# Altium project Mixed Signal Board Project.PrjPcb
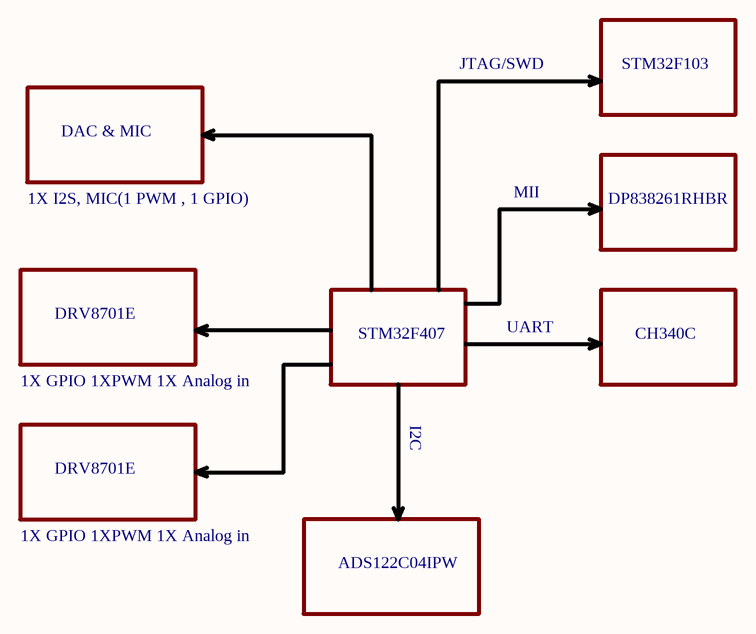
[diagram p0: [1]- Schematic Blocks.SchDoc]
9 sheets, 171 parts. Net scope: flat (ports and power ports of the same name join across sheets).
Board file: Mixed Signal Board Project.PcbDoc
Sheets:
  [1]- Schematic Blocks.SchDoc
  [3]-STM32F103 Debugger.SchDoc
  [4]- Ethernet PHY.SchDoc
  [5]-Motor Driver Schematic.SchDoc
  [6]-CH340C.SchDoc
  [8]-DAC and MIC.SchDoc
  [9]-STM32F407 Controller.SchDoc
  [10]-Motor Driver-2.SchDoc
  [11]- Power Input and Regulators.SchDoc

## Sheet [1]- Schematic Blocks.SchDoc: Sitara AM3358 Processor Board
size A4; Author: AVIRAL MISHRA; SheetNumber: 1; SheetTotal: 1; PROJECT CODE: A_V1.3

### Notes on the sheet
- JTAG/SWD
- STM32F103
- DAC & MIC
- 1X I2S, MIC(1 PWM , 1 GPIO)
- MII
- DP838261RHBR
- DRV8701E
- STM32F407
- UART
- CH340C
- 1X GPIO 1XPWM 1X Analog in
- I2C
- ADS122C04IPW
- TITLE:
- DOCUMENT NAME:
- SCALE 1:1
- This document is copyright of EsteemPCB and shall not be revealed, produced, copied, in whole or in part, nor
- PROJECT CODE:
- TEMPLATE:
- A4
- AUTHOR:
- Sheet
- of
- used for any purpose other than submitted.

## Sheet [3]-STM32F103 Debugger.SchDoc
size A4
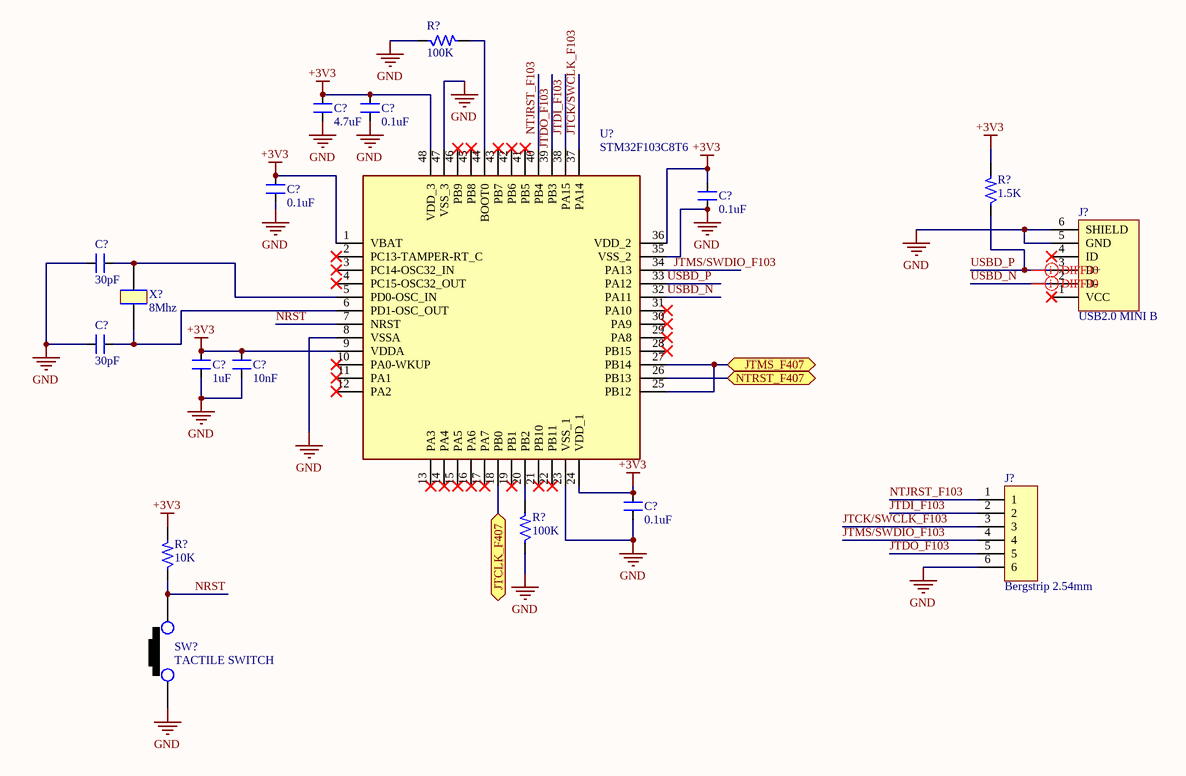
[diagram p1: [3]-STM32F103 Debugger.SchDoc]

### Parts
(Parts that share a designator on the sheet are numbered #1, #2 ... from top to bottom, then left to right.)
C?#1  4.7uF  [CAP_0805]
C?#2  0.1uF  [CAP_0805]
C?#3  0.1uF  [CAP_0805]
C?#4  0.1uF  [CAP_0805]
C?#5  30pF  [CAP_0805]
C?#6  30pF  [CAP_0805]
C?#7  1uF  [CAP_0805]
C?#8  10nF  [CAP_0805]
C?#9  0.1uF  [CAP_0805]
J?#1  USB2.0 MINI B  [CON_690-005-299-043]
J?#2  Bergstrip 2.54mm  [CON6_100_59D78_TH_ST]
R?#1  100K  [RES_0603]
R?#2  1.5K  [RES_0805]
R?#3  100K  [RES_0603]
R?#4  10K  [RES_0603]
SW?#1  TACTILE SWITCH  [SW_342_SMD]
U?#1  STM32F103C8T6  [LQFP-48_19.6_393_58X11_SMD]
X?#1  8Mhz  [XTAL_314_240X47_SMD]

### Ports
JTCLK_F407 (bidir), JTMS_F407 (bidir), NTRST_F407 (bidir)

### Nets
+3V3: C?#1.2 C?#2.2 C?#3.2 C?#4.2 C?#7.2 C?#8.2 C?#9.2 R?#2.2 R?#4.2 U?#1.1(VBAT) U?#1.9(VDDA) U?#1.24(VDD_1) U?#1.36(VDD_2) U?#1.48(VDD_3)
GND: C?#1.1 C?#2.1 C?#3.1 C?#4.1 C?#5.1 C?#6.1 C?#7.1 C?#8.1 C?#9.1 J?#1.5(GND) J?#1.6(SHIELD) J?#2.6 R?#1.1 R?#3.1 SW?#1.1 U?#1.8(VSSA) U?#1.23(VSS_1) U?#1.35(VSS_2) U?#1.47(VSS_3)  [project net SN]
JTCK/SWCLK_F103: J?#2.3 U?#1.37(PA14)
JTCLK_F407: U?#1.18(PB0) ; port JTCLK_F407
JTDI_F103: J?#2.2 U?#1.38(PA15)
JTDO_F103: J?#2.5 U?#1.39(PB3)
JTMS/SWDIO_F103: J?#2.4 U?#1.34(PA13)
JTMS_F407: U?#1.25(PB12) U?#1.27(PB14) ; port JTMS_F407
NRST: R?#4.1 SW?#1.2 U?#1.7(NRST)
NTJRST_F103: J?#2.1 U?#1.40(PB4)
NTRST_F407: U?#1.26(PB13) ; port NTRST_F407
USBD_N: J?#1.2(D-) U?#1.32(PA11)
USBD_P: J?#1.3(D+) R?#2.1 U?#1.33(PA12)
NetC?#5_2: C?#5.2 U?#1.5(PD0-OSC_IN) X?#1.2
NetC?#6_2: C?#6.2 U?#1.6(PD1-OSC_OUT) X?#1.1
NetR?#1_2: R?#1.2 U?#1.44(BOOT0)
NetR?#3_2: R?#3.2 U?#1.20(PB2)

Not connected (* = marked no-connect by the designer): J?#1 1(VCC)* 4(ID)*; U?#1 2(PC13-TAMPER-RT_C)* 3(PC14-OSC32_IN)* 4(PC15-OSC32_OUT)* 10(PA0-WKUP)* 11(PA1)* 12(PA2)* 13(PA3)* 14(PA4)* 15(PA5)* 16(PA6)* 17(PA7)* 19(PB1)* 21(PB10)* 22(PB11)* 28(PB15)* 29(PA8)* 30(PA9)* 31(PA10)* 41(PB5)* 42(PB6)* 43(PB7)* 45(PB8)* 46(PB9)*

### Layout directives
differential pair; differential pair class DIFF90: USBD_N, USBD_P

### Library data of the parts
C?#1 = CAP_4.7uF-50V-10%-0805: 4.7µF ±10% 50V Ceramic Capacitor X5R 0805 (2012 Metric) /; Manufacturer: Yageo; Manufacturer Part Number: GRM21BR61H475KE51L; Alternate Part Number-1: NA; Case/Package: 0805; Supplier-1: SIRICOM; Supplier Part Number-1: CL21A475KBQNNNE
C?#2-C?#4 C?#9 = CAP_0.1uF-50V-10%-0805: 0.1µF ±10% 50V Ceramic Capacitor X7R 0805 (2012 Metric) /; Manufacturer: Samsung; Manufacturer Part Number: CL21B104KBCNNNC; Alternate Part Number-1: NA; Case/Package: 0805; Supplier-1: SIRICOM; Supplier Part Number-1: 0805B104K500CT
C?#5 C?#6 = CAP_30pF-50V-10%-0805: ±10% 50V Ceramic Capacitor C0G, NP0 0805 (2012 Metric) /; Manufacturer Part Number: C0805C300K5GAC7800; Manufacturer: KEMET; Alternate Part Number: NA; Case/Package: 0805; Supplier-1: Digikey; Supplier Part Number-1: 399-17443-1-ND - Cut Tape (CT)
C?#7 = CAP_1uF-50V-5%-0805: 1µF ±5% 50V Ceramic Capacitor X7R 0805 (2012 Metric) /; Manufacturer: Samsung; Manufacturer Part Number: CC0805JKX7R9BB105; Alternate Part Number-1: 0805F105M500NT; Case/Package: 0805; Supplier-1: SIRICOM; Supplier Part Number-1: CL21B105KBFNNNE
C?#8 = CAP_10nF-50V-10%-0805: 10000pF ±10% 50V Ceramic Capacitor X7R 0805 (2012 Metric) /; Manufacturer: Samsung; Manufacturer Part Number: C0805C103K5RECAUTO; Alternate Part Number-1: GRM2195C1H103JA01D; Case/Package: 0805; Supplier-1: SIRICOM; Supplier Part Number-1: 0805B103K500CT
J?#1 = CON_USB2.0-MINIB-SMD: USB - mini B USB 2.0 Receptacle Connector 5 Position Surface Mount, Right Angle; Manufacturer: EDAC; Manufacturer Part Number: 690-005-299-043; Alternate Part Number-1: NA; Case/Package: USB-MINI-B; Supplier-1: LCSC; Supplier Part Number-1: C105424
J?#2 = CON-BS-SKT_6X1-100-ST-TH: 6 Pins, 1 Row 2.54mm Pitch, Straight bergstrip, Female; Manufacturer: Molex; Alternate Part Number-1: NA; Manufacturer Part Number: 22-10-2061; Case/Package: TH-CON; Supplier-1: SP ROAD; Supplier Part Number-1: NA
R?#1 R?#3 = RES_100K-0.1W-1%-0603: 100 kOhms ±1% 0.1W, 1/10W Chip Resistor 0603 (1608 Metric) Automotive AEC-Q200 Thick Film /; Manufacturer: Stackpole Electronics; Manufacturer Part Number: RMCF0603FT100K; Alternate Part Number-1: NA; Case/Package: 0603; Supplier-1: Arrow; Supplier Part Number-1: RMCF0603FT100K
R?#2 = RES_1.5K-0.125W-1%-0805: 1.5 kOhms ±1% 0.125W, 1/8W Chip Resistor 0805 (2012 Metric) Thick Film /; Manufacturer: TE Connectivity Passive Product; Manufacturer Part Number: CRG0805F1K5; Alternate Part Number-1: NA; Case/Package: 0805; Supplier-1: SIRICOM; Supplier Part Number-1: NA
R?#4 = RES_10K-0.1W-1%-0603: 10 kOhms ±1% 0.1W, 1/10W Chip Resistor 0603 (1608 Metric) Automotive AEC-Q200 Thick Film /; Manufacturer: Walsin; Manufacturer Part Number: WR06X1002FTL; Alternate Part Number-1: 0603WAJ0103T5E; Case/Package: 0603; Supplier-1: SIRICOM; Supplier Part Number-1: WR06X1002FTL
SW?#1 = SW1_RS-282G05A3-SMRT-SMD: Tactile Switch SPST-NO Top Actuated Surface Mount; Manufacturer: ITT C&K; Alternate Part Number-1: NA; Manufacturer Part Number: RS-282G05A3-SMRT; Case/Package: SMD; Supplier-1: SP ROAD; Supplier Part Number-1: RS-282G05A3-SMRT
U?#1 = IC_STM32F103C8T6: ARM® Cortex®-M3 STM32F1 Microcontroller IC 32-Bit 72MHz 64KB (64K x 8) FLASH 48-LQFP (7x7) /; Manufacturer: STMicroelectronics; Alternate Part Number-1: NA; Manufacturer Part Number: STM32F103C8T6; Case/Package: LQFP48; Supplier-1: LCSC; Supplier Part Number-1: STM32F103C8T6
X?#1 = XTAL_8MHZ-ECS-80-32-5PX-SMD: 8MHz ±30ppm Crystal 32pF 60 Ohms HC-49/US /; Manufacturer: Fox Electronics; Manufacturer Part Number: ECS-80-32-5PX-TR; Alternate Part Number-1: NA; Case/Package: SMD/SMT; Supplier-1: SP ROAD; Supplier Part Number-1: ECS-80-32-5PX-TR

## Sheet [4]- Ethernet PHY.SchDoc
size A4
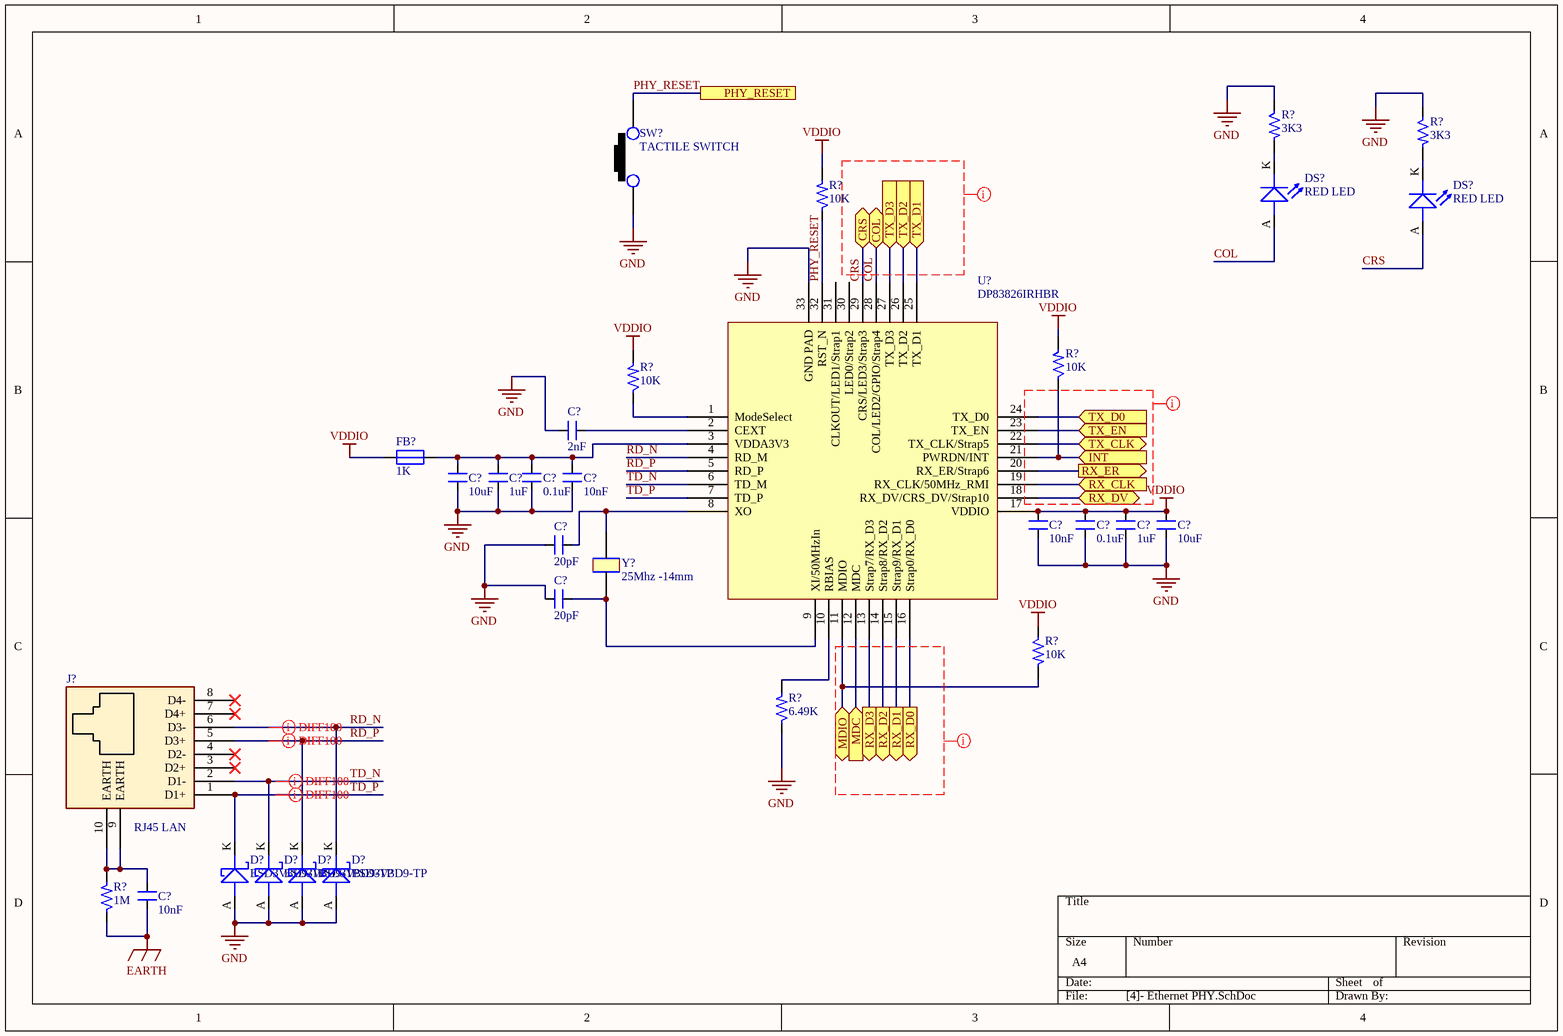
[diagram p2: [4]- Ethernet PHY.SchDoc]

### Parts
(Parts that share a designator on the sheet are numbered #1, #2 ... from top to bottom, then left to right.)
C?#10  2nF
C?#11  10uF  [CAP_1206]
C?#12  1uF  [CAP_0805]
C?#13  0.1uF  [CAP_0805]
C?#14  10nF  [CAP_0805]
C?#15  10nF  [CAP_0805]
C?#16  0.1uF  [CAP_0805]
C?#17  1uF  [CAP_0805]
C?#18  10uF  [CAP_1206]
C?#19  20pF  [CAP_0805]
C?#20  20pF  [CAP_0805]
C?#21  10nF  [CAP_P196_102X287_H332_RAD_TH]
D?#1  ESD3V3D9-TP
D?#2  ESD3V3D9-TP
D?#3  ESD3V3D9-TP
D?#4  ESD3V3D9-TP
DS?#1  RED LED  [LED_0805]
DS?#2  RED LED  [LED_0805]
FB?#1  1K  [IND_0805]
J?#3  RJ45 LAN  [CON10_P106_RJ45_TH_ST]
R?#5  3K3  [RES_0603]
R?#6  3K3  [RES_0603]
R?#7  10K  [RES_0603]
R?#8  10K  [RES_0603]
R?#9  10K  [RES_0603]
R?#10  10K  [RES_0603]
R?#11  6.49K  [RES_0805]
R?#12  1M  [RES_1206]
SW?#2  TACTILE SWITCH  [SW_342_SMD]
U?#2  DP83826IRHBR
Y?  25Mhz -14mm  [XTAL_314_240X47_SMD]

### Ports
COL (bidir), CRS (bidir), INT (in), MDC (in), MDIO (bidir), PHY_RESET, RX_CLK (in), RX_D0 (out), RX_D1 (out), RX_D2 (out), RX_D3 (out), RX_DV (bidir), RX_ER (out), TX_CLK (bidir), TX_D0 (in), TX_D1 (in), TX_D2 (in), TX_D3 (in), TX_EN (in)

### Nets
EARTH: C?#21.1 R?#12.1
GND: C?#10.1 C?#11.1 C?#12.1 C?#13.1 C?#14.1 C?#15.1 C?#16.1 C?#17.1 C?#18.1 C?#19.1 C?#20.1 D?#1.A D?#2.A D?#3.A D?#4.A R?#5.1 R?#6.1 R?#11.1 SW?#2.1 U?#2.33(GND_PAD)  [project net SN]
VDDIO: C?#15.2 C?#16.2 C?#17.2 C?#18.2 FB?#1.1 R?#7.2 R?#8.2 R?#9.2 R?#10.1 U?#2.17(VDDIO)
COL: DS?#1.A(ANODE) U?#2.28(COL/LED2/GPIO/Strap4) ; port COL
CRS: DS?#2.A(ANODE) U?#2.29(CRS/LED3/Strap3) ; port CRS
INT: R?#8.1 U?#2.21(PWRDN/INT) ; port INT
MDC: U?#2.12(MDC) ; port MDC
MDIO: R?#10.2 U?#2.11(MDIO) ; port MDIO
PHY_RESET: R?#7.1 SW?#2.2 U?#2.32(RST_N) ; port PHY_RESET
RD_N: D?#4.K J?#3.6(D3-) U?#2.4(RD_M)
RD_P: D?#3.K J?#3.5(D3+) U?#2.5(RD_P)
RX_CLK: U?#2.19(RX_CLK/50MHz_RMI) ; port RX_CLK
RX_D0: U?#2.16(Strap0/RX_D0) ; port RX_D0
RX_D1: U?#2.15(Strap9/RX_D1) ; port RX_D1
RX_D2: U?#2.14(Strap8/RX_D2) ; port RX_D2
RX_D3: U?#2.13(Strap7/RX_D3) ; port RX_D3
RX_DV: U?#2.18(RX_DV/CRS_DV/Strap10) ; port RX_DV
RX_ER: U?#2.20(RX_ER/Strap6) ; port RX_ER
TD_N: D?#2.K J?#3.2(D1-) U?#2.6(TD_M)
TD_P: D?#1.K J?#3.1(D1+) U?#2.7(TD_P)
TX_CLK: U?#2.22(TX_CLK/Strap5) ; port TX_CLK
TX_D0: U?#2.24(TX_D0) ; port TX_D0
TX_D1: U?#2.25(TX_D1) ; port TX_D1
TX_D2: U?#2.26(TX_D2) ; port TX_D2
TX_D3: U?#2.27(TX_D3) ; port TX_D3
TX_EN: U?#2.23(TX_EN) ; port TX_EN
NetC?#10_2: C?#10.2 U?#2.2(CEXT)
NetC?#11_2: C?#11.2 C?#12.2 C?#13.2 C?#14.2 FB?#1.2 U?#2.3(VDDA3V3)
NetC?#19_2: C?#19.2 U?#2.8(XO) Y?.2
NetC?#20_2: C?#20.2 U?#2.9(XI/50MHzIn) Y?.1
NetC?#21_2: C?#21.2 J?#3.9(EARTH) J?#3.10(EARTH) R?#12.2
NetDS?#1_K: DS?#1.K(CATHODE) R?#5.2
NetDS?#2_K: DS?#2.K(CATHODE) R?#6.2
NetR?#9_1: R?#9.1 U?#2.1(ModeSelect)
NetR?#11_2: R?#11.2 U?#2.10(RBIAS)

Not connected (* = marked no-connect by the designer): J?#3 3(D2+)* 4(D2-)* 7(D4+)* 8(D4-)*; U?#2 30(LED0/Strap2) 31(CLKOUT/LED1/Strap1)

### Layout directives
differential pair; differential pair class DIFF100: RD_N, RD_P, TD_N, TD_P
net class 50OHM: (no net found under the mark)

### Library data of the parts
C?#10 = CAP_2nF-50V-10%-0805: 2000pF ±10% 50V Ceramic Capacitor X7R 0805 (2012 Metric) /; Parameter 1: *
C?#11 C?#18 = CAP_10uF-50V-10%-1206: 10µF ±10% 50V Ceramic Capacitor X7R 1206 (3216 Metric) /; Manufacturer: KEMET; Manufacturer Part Number: CL31B106KBHNNNE; Alternate Part Number-1: GRT31CR61H106ME01L; Case/Package: 1206; Supplier-1: SIRICOM; Supplier Part Number-1: CC1206KKX5R9BB106
C?#12 C?#17 = CAP_1uF-50V-5%-0805: as C?#7 on sheet [3]-STM32F103 Debugger; Case/Package: 0805; Supplier-1: SIRICOM; Supplier Part Number-1: CL21B105KBFNNNE
C?#13 C?#16 = CAP_0.1uF-50V-10%-0805: as C?#2 on sheet [3]-STM32F103 Debugger; Case/Package: 0805; Supplier-1: SIRICOM; Supplier Part Number-1: 0805B104K500CT
C?#14 C?#15 = CAP_10nF-50V-10%-0805: as C?#8 on sheet [3]-STM32F103 Debugger; Case/Package: 0805; Supplier-1: SIRICOM; Supplier Part Number-1: 0805B103K500CT
C?#19 C?#20 = CAP_20pF-50V-10%-0805: ±10% 50V Ceramic Capacitor C0G, NP0 0805 (2012 Metric) /; Manufacturer: AVX Corporation; Manufacturer Part Number: 08055A200KAT2A; Alternate Part Number-1: NA; Case/Package: 0805; Supplier-1: Digikey; Supplier Part Number-1: 478-11887-1-ND - Cut Tape (CT)
C?#21 = CAP_10nF-1KV-10%-RAD-TH: 10000pF ±10% 1000V (1kV) Ceramic Capacitor X7R Radial /; Manufacturer: Yageo; Manufacturer Part Number: RDER73A103K2K1H03B; Alternate Part Number-1: NA; Case/Package: TH; Supplier-1: SP ROAD; Supplier Part Number-1: RDER73A103K2K1H03B
D?#1-D?#4 = DIO-T_3.3V-8.8V-SOD923: 8.8V Clamp 5A (8/20µs) Ipp Tvs Diode Surface Mount SOD-923 /
DS?#1 DS?#2 = LED_RED-2V-20mA-0805: Red 631nm LED Indication - Discrete 2V 0805 (2012 Metric); Manufacturer: Vishay Lite-On; Manufacturer Part Number: LTST-C171KRKT; Alternate Part Number-1: NA; Case/Package: 0805; Supplier-1: SP ROAD; Supplier Part Number-1: LTST-C171KRKT
FB?#1 = FB_1K-100MHZ-1.6A-0805: 1 kOhms @ 100MHz 1 Power Line Ferrite Bead 0805 (2012 Metric) 1.6A; Manufacturer: Laird; Manufacturer Part Number: BLM21SP102SH1D; Alternate Part Number-1: NA; Case/Package: 0805; Supplier-1: SIRICOM; Supplier Part Number-1: ACMS201209A102
J?#3 = CON-SKT-RJ_8C8P-RA-TH: 8 Pins, 2 Row 2.54mm Pitch, right angle Connector, male; Manufacturer: Assmann; Manufacturer Part Number: A-2004-2-4-LPS-N-R; Alternate Part Number-1: NA; Case/Package: TH-CON; Supplier-1: SP ROAD; Supplier Part Number-1: A-2004-2-4-LPS-N-R
R?#5 R?#6 = RES_3.3K-0.1W-1%-0603: 3.3 kOhms ±1% 0.1W, 1/10W Chip Resistor 0603 (1608 Metric) Automotive AEC-Q200 Thick Film /; Manufacturer: Wilson; Manufacturer Part Number: WR06X3301FTL; Alternate Part Number-1: 0603WAF3301T5E; Case/Package: 0603; Supplier-1: SIRICOM; Supplier Part Number-1: WR06X3301FTL
R?#7-R?#10 = RES_10K-0.1W-1%-0603: as R?#4 on sheet [3]-STM32F103 Debugger; Case/Package: 0603; Supplier-1: SIRICOM; Supplier Part Number-1: WR06X1002FTL
R?#11 = RES_6.49K-0.125W-1%-0805: 6.49 kOhms ±1% 0.125W, 1/8W Chip Resistor 0805 (2012 Metric) Moisture Resistant Thick Film /; Manufacturer: Stackpole Electronics; Manufacturer Part Number: RC0805FR-076K49L; Alternate Part Number-1: NA; Case/Package: 0805; Supplier-1: SIRICOM; Supplier Part Number-1: WRO8X6491FTL
R?#12 = RES_1M-0.25W-1%-1206: 1 MOhms ±1% 0.25W, 1/4W Chip Resistor 1206 (3216 Metric) Automotive AEC-Q200, High Voltage Thick Film /; Manufacturer: Walsin; Manufacturer Part Number: WR12X1004FTL; Alternate Part Number-1: NA; Case/Package: 1206; Supplier-1: SIRICOM; Supplier Part Number-1: WR12X1004FTL
SW?#2 = SW1_RS-282G05A3-SMRT-SMD: as SW?#1 on sheet [3]-STM32F103 Debugger; Manufacturer Part Number: RS-282G05A3-SMRT; Case/Package: SMD; Supplier-1: SP ROAD; Supplier Part Number-1: RS-282G05A3-SMRT
U?#2 = IC_DP83826IRHBR
Y? = XTAL_25Mhz-FOXSDLF/250F-20: 25MHz ±30ppm Crystal 20pF 30 Ohms HC-49/US /; Manufacturer: Abracon; Alternate Part Number-1: NA; Manufacturer Part Number: FOXSDLF/250F-20; Case/Package: SMD; Supplier-1: MOUSER; Supplier Part Number-1: FOXSDLF/250F-20

## Sheet [5]-Motor Driver Schematic.SchDoc
size A4
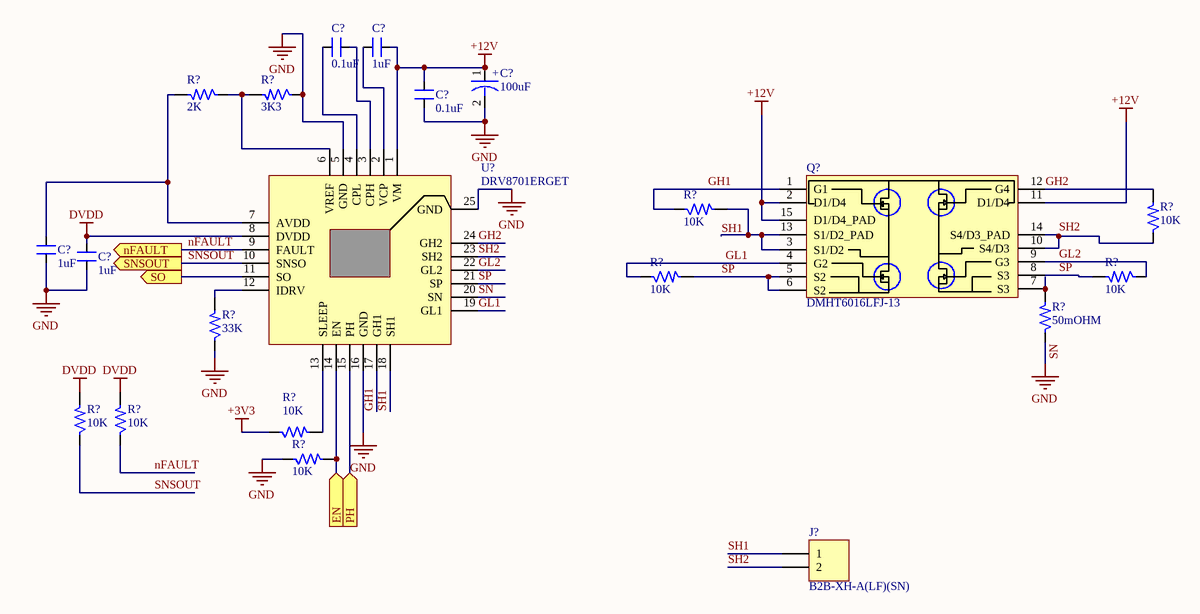
[diagram p3: [5]-Motor Driver Schematic.SchDoc]

### Parts
(Parts that share a designator on the sheet are numbered #1, #2 ... from top to bottom, then left to right.)
C?#22  0.1uF  [CAP_0805]
C?#23  1uF  [CAP_0805]
C?#24  100uF  [ACAP_P236_D305_H303_RAD]
C?#25  0.1uF  [CAP_0805]
C?#26  1uF  [CAP_0805]
C?#27  1uF  [CAP_0805]
J?#4  B2B-XH-A(LF)(SN)  [CON2_100_B2B-XH-A_TH_ST]
Q?#1  DMHT6016LFJ-13  [DFN5045-12_33_212_27X15_SMD_1]
R?#13  2K  [RES_0603]
R?#14  3K3  [RES_0603]
R?#15  10K  [RES_0603]
R?#16  10K  [RES_0603]
R?#17  10K  [RES_0603]
R?#18  10K  [RES_0603]
R?#19  50mOHM  [RES_2512]
R?#20  33K  [RES_0805]
R?#21  10K  [RES_0603]
R?#22  10K  [RES_0603]
R?#23  10K  [RES_0603]
R?#24  10K  [RES_0603]
U?#3  DRV8701ERGET  [VFQFN24_19.6_196_12X32_SMD_1]

### Ports
EN (in), nFAULT (out), PH (in), SNSOUT (out), SO (out)

### Nets
+3V3: R?#21.1
+12V: C?#23.2 C?#24.1 C?#25.2 Q?#1.2(D1/D4) Q?#1.11(D1/D4) Q?#1.15(D1/D4_PAD) U?#3.1(VM)
DVDD: C?#27.2 R?#22.2 R?#23.2 U?#3.8(DVDD)
SN: C?#24.2 C?#25.1 C?#26.1 C?#27.1 R?#14.1 R?#19.1 R?#20.1 R?#24.1 U?#3.5(GND) U?#3.16(GND) U?#3.20(SN) U?#3.25(GND)  [also labelled GND]
EN: R?#24.2 U?#3.14(EN) ; port EN
GH1: Q?#1.1(G1) R?#15.1 U?#3.17(GH1)
GH2: Q?#1.12(G4) R?#16.2 U?#3.24(GH2)
GL1: Q?#1.4(G2) R?#17.1 U?#3.19(GL1)
GL2: Q?#1.9(G3) R?#18.1 U?#3.22(GL2)
nFAULT: R?#23.1 U?#3.9(FAULT) ; port nFAULT
PH: U?#3.15(PH) ; port PH
SH1: J?#4.1 Q?#1.3(S1/D2) Q?#1.13(S1/D2_PAD) R?#15.2 U?#3.18(SH1)
SH2: J?#4.2 Q?#1.10(S4/D3) Q?#1.14(S4/D3_PAD) R?#16.1 U?#3.23(SH2)
SNSOUT: R?#22.1 U?#3.10(SNSO) ; port SNSOUT
SO: U?#3.11(SO) ; port SO
SP: Q?#1.5(S2) Q?#1.6(S2) Q?#1.8(S3) R?#17.2 R?#18.2 U?#3.21(SP)
NetC?#22_1: C?#22.1 U?#3.3(CPH)
NetC?#22_2: C?#22.2 U?#3.4(CPL)
NetC?#23_1: C?#23.1 U?#3.2(VCP)
NetC?#26_2: C?#26.2 R?#13.2 U?#3.7(AVDD)
NetQ?#1_7: Q?#1.7(S3) R?#19.2
NetR?#13_1: R?#13.1 R?#14.2 U?#3.6(VREF)
NetR?#20_2: R?#20.2 U?#3.12(IDRV)
NetR?#21_2: R?#21.2 U?#3.13(SLEEP)

### Notes on the sheet
- (in symbol CAP-P_100uF-25V-20%-RAD) +

### Library data of the parts
C?#22 C?#25 = CAP_0.1uF-50V-10%-0805: as C?#2 on sheet [3]-STM32F103 Debugger; Case/Package: 0805; Supplier-1: SIRICOM; Supplier Part Number-1: 0805B104K500CT
C?#23 C?#26 C?#27 = CAP_1uF-50V-5%-0805: as C?#7 on sheet [3]-STM32F103 Debugger; Case/Package: 0805; Supplier-1: SIRICOM; Supplier Part Number-1: CL21B105KBFNNNE
C?#24 = CAP-P_100uF-25V-20%-RAD: 100µF 25V Aluminum Electrolytic Capacitors Radial, Can - SMD 1000 Hrs @ 105°C /; Manufacturer: Nichicon; Manufacturer Part Number: UWT1E101MCL1GS; Alternate Part Number-1: NA; Case/Package: Radial-SMD; Supplier-1: SP ROAD; Supplier Part Number-1: UWT1E101MCL1GS
J?#4 = CON-PLG_2X1-100-ST-TH: 2 Pins, 1 Row 2.54mm Pitch, Straight Connector, male; Manufacturer: JST; Mating Part Number: XHP-2; Crimp Part Number: ASXHSXH22K51; Alternate Part Number-1: NA; Manufacturer Part Number: B2B-XH-A(LF)(SN); Case/Package: TH-CON; Supplier-1: SP ROAD; Supplier Part Number-1: B2B-XH-A(LF)(SN)
Q?#1 = MOSFET-N_60V-14.8A-V-DFN5045-12: Mosfet Array 4 N-Channel 14.8A (Ta) Surface Mount V-DFN5045-12; Manufacturer: ON Semiconductor; Alternate Part Number-1: DMHT3006LFJ-13; Manufacturer Part Number: DMHT6016LFJ-13; Case/Package: DFN5045-12; Supplier-1: LCSC; Supplier Part Number-1: C460986
R?#13 = RES_2K-0.125W-1%-0603: 2 kOhms ±1% 0.125W, 1/8W Chip Resistor 0603 (1608 Metric) Anti-Sulfur, Moisture Resistant Thin Film /; Manufacturer: Stackpole Electronics; Manufacturer Part Number: RNCP0603FTD2K00; Alternate Part Number-1: NA; Case/Package: 0603; Supplier-1: SIRICOM; Supplier Part Number-1: WR06X2001FTL
R?#14 = RES_3.3K-0.1W-1%-0603: as R?#5 on sheet [4]- Ethernet PHY; Case/Package: 0603; Supplier-1: SIRICOM; Supplier Part Number-1: WR06X3301FTL
R?#15-R?#18 R?#21-R?#24 = RES_10K-0.1W-1%-0603: as R?#4 on sheet [3]-STM32F103 Debugger; Case/Package: 0603; Supplier-1: SIRICOM; Supplier Part Number-1: WR06X1002FTL
R?#19 = RES_50mOhm-2W-1%-2512: 50 mOhms ±1% 2W Chip Resistor 2512 (6432 Metric) Automotive AEC-Q200, Current Sense, Moisture Resistant Metal Element /; Manufacturer: Yageo; Manufacturer Part Number: PA2512FKF7W0R05E; Alternate Part Number-1: PMR100HZPFU5L00; Case/Package: 2512; Supplier-1: SIRICOM; Supplier Part Number-1: LR2512-22R060F1
R?#20 = RES_33K-0.125W-1%-0805: Thick Film Resistors - SMD 33KOhms 1/8W 150V33 kOhms ±1% 0.125W, 1/8W Chip Resistor 0805 (2012 Metric) Thick Film /; Manufacturer: Vishay BCcomponents; Manufacturer Part Number: CRG0805F33K; Alternate Part Number-1: NA; Case/Package: 0805; Supplier-1: SIRICOM; Supplier Part Number-1: WR08X3302FTL
U?#3 = IC_DRV8701ERGET: Motor Driver Power MOSFET Parallel 24-VQFN (4x4); Manufacturer: Texas Instruments; Alternate Part Number-1: NA; Manufacturer Part Number: DRV8701ERGET; Case/Package: VFQFN24; Supplier-1: ARROW; Supplier Part Number-1: DRV8701ERGET

## Sheet [6]-CH340C.SchDoc
size A4
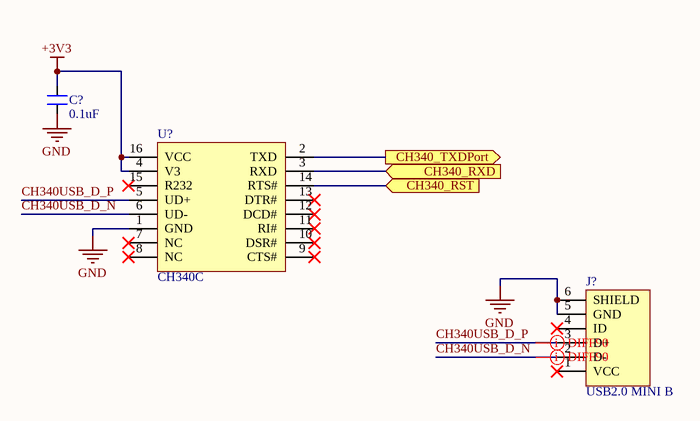
[diagram p4: [6]-CH340C.SchDoc]

### Parts
(Parts that share a designator on the sheet are numbered #1, #2 ... from top to bottom, then left to right.)
C?#28  0.1uF  [CAP_0805]
J?#5  USB2.0 MINI B  [CON_690-005-299-043]
U?#4  CH340C  [SOIC16_50_284_25X90_SMT]

### Ports
CH340_RST (in), CH340_RXD (in), CH340_TXDPort (out)

### Nets
+3V3: C?#28.2 U?#4.4(V3) U?#4.16(VCC)
GND: C?#28.1 J?#5.5(GND) J?#5.6(SHIELD) U?#4.1(GND)  [project net SN]
CH340_RST: U?#4.14(RTS#) ; port CH340_RST
CH340_RXD: U?#4.3(RXD) ; port CH340_RXD
CH340_TXDPort: U?#4.2(TXD) ; port CH340_TXDPort
CH340USB_D_N: J?#5.2(D-) U?#4.6(UD-)
CH340USB_D_P: J?#5.3(D+) U?#4.5(UD+)

Not connected (* = marked no-connect by the designer): J?#5 1(VCC)* 4(ID)*; U?#4 7(NC)* 8(NC)* 9(CTS#)* 10(DSR#)* 11(RI#)* 12(DCD#)* 13(DTR#)* 15(R232)*

### Layout directives
differential pair; differential pair class DIFF90: CH340USB_D_N, CH340USB_D_P

### Library data of the parts
C?#28 = CAP_0.1uF-50V-10%-0805: as C?#2 on sheet [3]-STM32F103 Debugger; Case/Package: 0805; Supplier-1: SIRICOM; Supplier Part Number-1: 0805B104K500CT
J?#5 = CON_USB2.0-MINIB-SMD: as J?#1 on sheet [3]-STM32F103 Debugger; Case/Package: USB-MINI-B; Supplier-1: LCSC; Supplier Part Number-1: C105424
U?#4 = IC_CH340C: USB Bridge, USB to UART USB 2.0 UART Interface; Manufacturer: Olimex; Alternate Part Number-1: NA; Manufacturer Part Number: CH340C; Case/Package: SOIC16; Supplier-1: LCSC; Supplier Part Number-1: C84681

## Sheet [8]-DAC and MIC.SchDoc
size A4
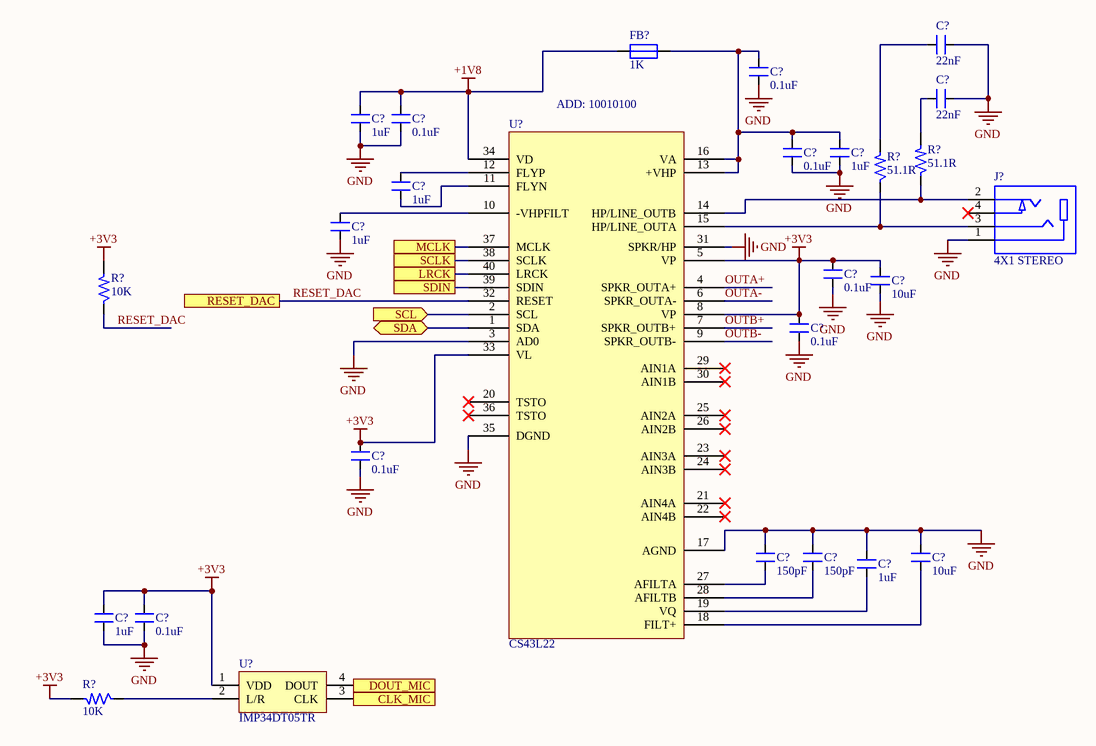
[diagram p5: [8]-DAC and MIC.SchDoc]

### Parts
(Parts that share a designator on the sheet are numbered #1, #2 ... from top to bottom, then left to right.)
C?#29  22nF
C?#30  0.1uF  [CAP_0805]
C?#31  22nF
C?#32  1uF  [CAP_0805]
C?#33  0.1uF  [CAP_0805]
C?#34  0.1uF  [CAP_0805]
C?#35  1uF  [CAP_0805]
C?#36  1uF  [CAP_0805]
C?#37  1uF  [CAP_0805]
C?#38  0.1uF  [CAP_0805]
C?#39  10uF  [CAP_1206]
C?#40  0.1uF  [CAP_0805]
C?#41  0.1uF  [CAP_0805]
C?#42  150pF
C?#43  150pF
C?#44  10uF  [CAP_1206]
C?#45  1uF  [CAP_0805]
C?#46  1uF  [CAP_0805]
C?#47  0.1uF  [CAP_0805]
FB?#2  1K  [IND_0805]
J?#6  4X1 STEREO
R?#25  51.1R
R?#26  51.1R
R?#27  10K  [RES_0603]
R?#28  10K  [RES_0603]
U?#5  CS43L22
U?#6  IMP34DT05TR

### Ports
CLK_MIC (in), DOUT_MIC (out), LRCK, MCLK, RESET_DAC, SCL (in), SCLK, SDA (bidir), SDIN

### Nets
+1V8: C?#32.2 C?#33.2 FB?#2.1 U?#5.34(VD)
+3V3: C?#38.2 C?#39.2 C?#40.2 C?#41.2 C?#46.2 C?#47.2 R?#27.2 R?#28.2 U?#5.5(VP) U?#5.8(VP) U?#5.33(VL) U?#6.1(VDD)
GND: C?#29.2 C?#30.1 C?#31.2 C?#32.1 C?#33.1 C?#34.1 C?#35.1 C?#37.1 C?#38.1 C?#39.1 C?#40.1 C?#41.1 C?#42.2 C?#43.2 C?#44.2 C?#45.2 C?#46.1 C?#47.1 J?#6.1 U?#5.3(AD0) U?#5.17(AGND) U?#5.31(SPKR/HP) U?#5.35(DGND)  [project net SN]
CLK_MIC: U?#6.3(CLK) ; port CLK_MIC
DOUT_MIC: U?#6.4(DOUT) ; port DOUT_MIC
LRCK: U?#5.40(LRCK) ; port LRCK
MCLK: U?#5.37(MCLK) ; port MCLK
OUTA+: U?#5.4(SPKR_OUTA+)
OUTA-: U?#5.6(SPKR_OUTA-)
OUTB+: U?#5.7(SPKR_OUTB+)
OUTB-: U?#5.9(SPKR_OUTB-)
RESET_DAC: R?#27.1 U?#5.32(RESET) ; port RESET_DAC
SCL: U?#5.2(SCL) ; port SCL
SCLK: U?#5.38(SCLK) ; port SCLK
SDA: U?#5.1(SDA) ; port SDA
SDIN: U?#5.39(SDIN) ; port SDIN
NetC?#29_1: C?#29.1 R?#26.2
NetC?#30_2: C?#30.2 C?#34.2 C?#35.2 FB?#2.2 U?#5.13(+VHP) U?#5.16(VA)
NetC?#31_1: C?#31.1 R?#25.2
NetC?#36_1: C?#36.1 U?#5.11(FLYN)
NetC?#36_2: C?#36.2 U?#5.12(FLYP)
NetC?#37_2: C?#37.2 U?#5.10(-VHPFILT)
NetC?#42_1: C?#42.1 U?#5.27(AFILTA)
NetC?#43_1: C?#43.1 U?#5.28(AFILTB)
NetC?#44_1: C?#44.1 U?#5.18(FILT+)
NetC?#45_1: C?#45.1 U?#5.19(VQ)
NetJ?#6_2: J?#6.2 R?#25.1 U?#5.14(HP/LINE_OUTB)
NetJ?#6_3: J?#6.3 R?#26.1 U?#5.15(HP/LINE_OUTA)
NetR?#28_1: R?#28.1 U?#6.2(L/R)

Not connected (* = marked no-connect by the designer): J?#6 4*; U?#5 20(TSTO)* 21(AIN4A)* 22(AIN4B)* 23(AIN3A)* 24(AIN3B)* 25(AIN2A)* 26(AIN2B)* 29(AIN1A)* 30(AIN1B)* 36(TSTO)*

### Notes on the sheet
- ADD: 10010100

### Library data of the parts
C?#29 C?#31 = CAP_22nF-50V-10%-0805
C?#30 C?#33 C?#34 C?#38 C?#40 C?#41 C?#47 = CAP_0.1uF-50V-10%-0805: as C?#2 on sheet [3]-STM32F103 Debugger; Case/Package: 0805; Supplier-1: SIRICOM; Supplier Part Number-1: 0805B104K500CT
C?#32 C?#35-C?#37 C?#45 C?#46 = CAP_1uF-50V-5%-0805: as C?#7 on sheet [3]-STM32F103 Debugger; Case/Package: 0805; Supplier-1: SIRICOM; Supplier Part Number-1: CL21B105KBFNNNE
C?#39 C?#44 = CAP_10uF-50V-10%-1206: as C?#11 on sheet [4]- Ethernet PHY; Case/Package: 1206; Supplier-1: SIRICOM; Supplier Part Number-1: CC1206KKX5R9BB106
C?#42 C?#43 = CAP_150pF-50V-10%-0805
FB?#2 = FB_1K-100MHZ-1.6A-0805: as FB?#1 on sheet [4]- Ethernet PHY; Case/Package: 0805; Supplier-1: SIRICOM; Supplier Part Number-1: ACMS201209A102
J?#6 = CON-PLG-STEREO_4X1-100-RA-SMD
R?#25 R?#26 = RES_51.1R-0.1W-1%-0603
R?#27 R?#28 = RES_10K-0.1W-1%-0603: as R?#4 on sheet [3]-STM32F103 Debugger; Case/Package: 0603; Supplier-1: SIRICOM; Supplier Part Number-1: WR06X1002FTL
U?#5 = IC_CS43L22
U?#6 = IC_IMP34DT05TR

## Sheet [9]-STM32F407 Controller.SchDoc
size A3; Organization: Altium Limited; Address1: L3, 12a Rodborough Rd; Address2: Frenchs Forest; Address3: NSW; Address4: Australia 2086
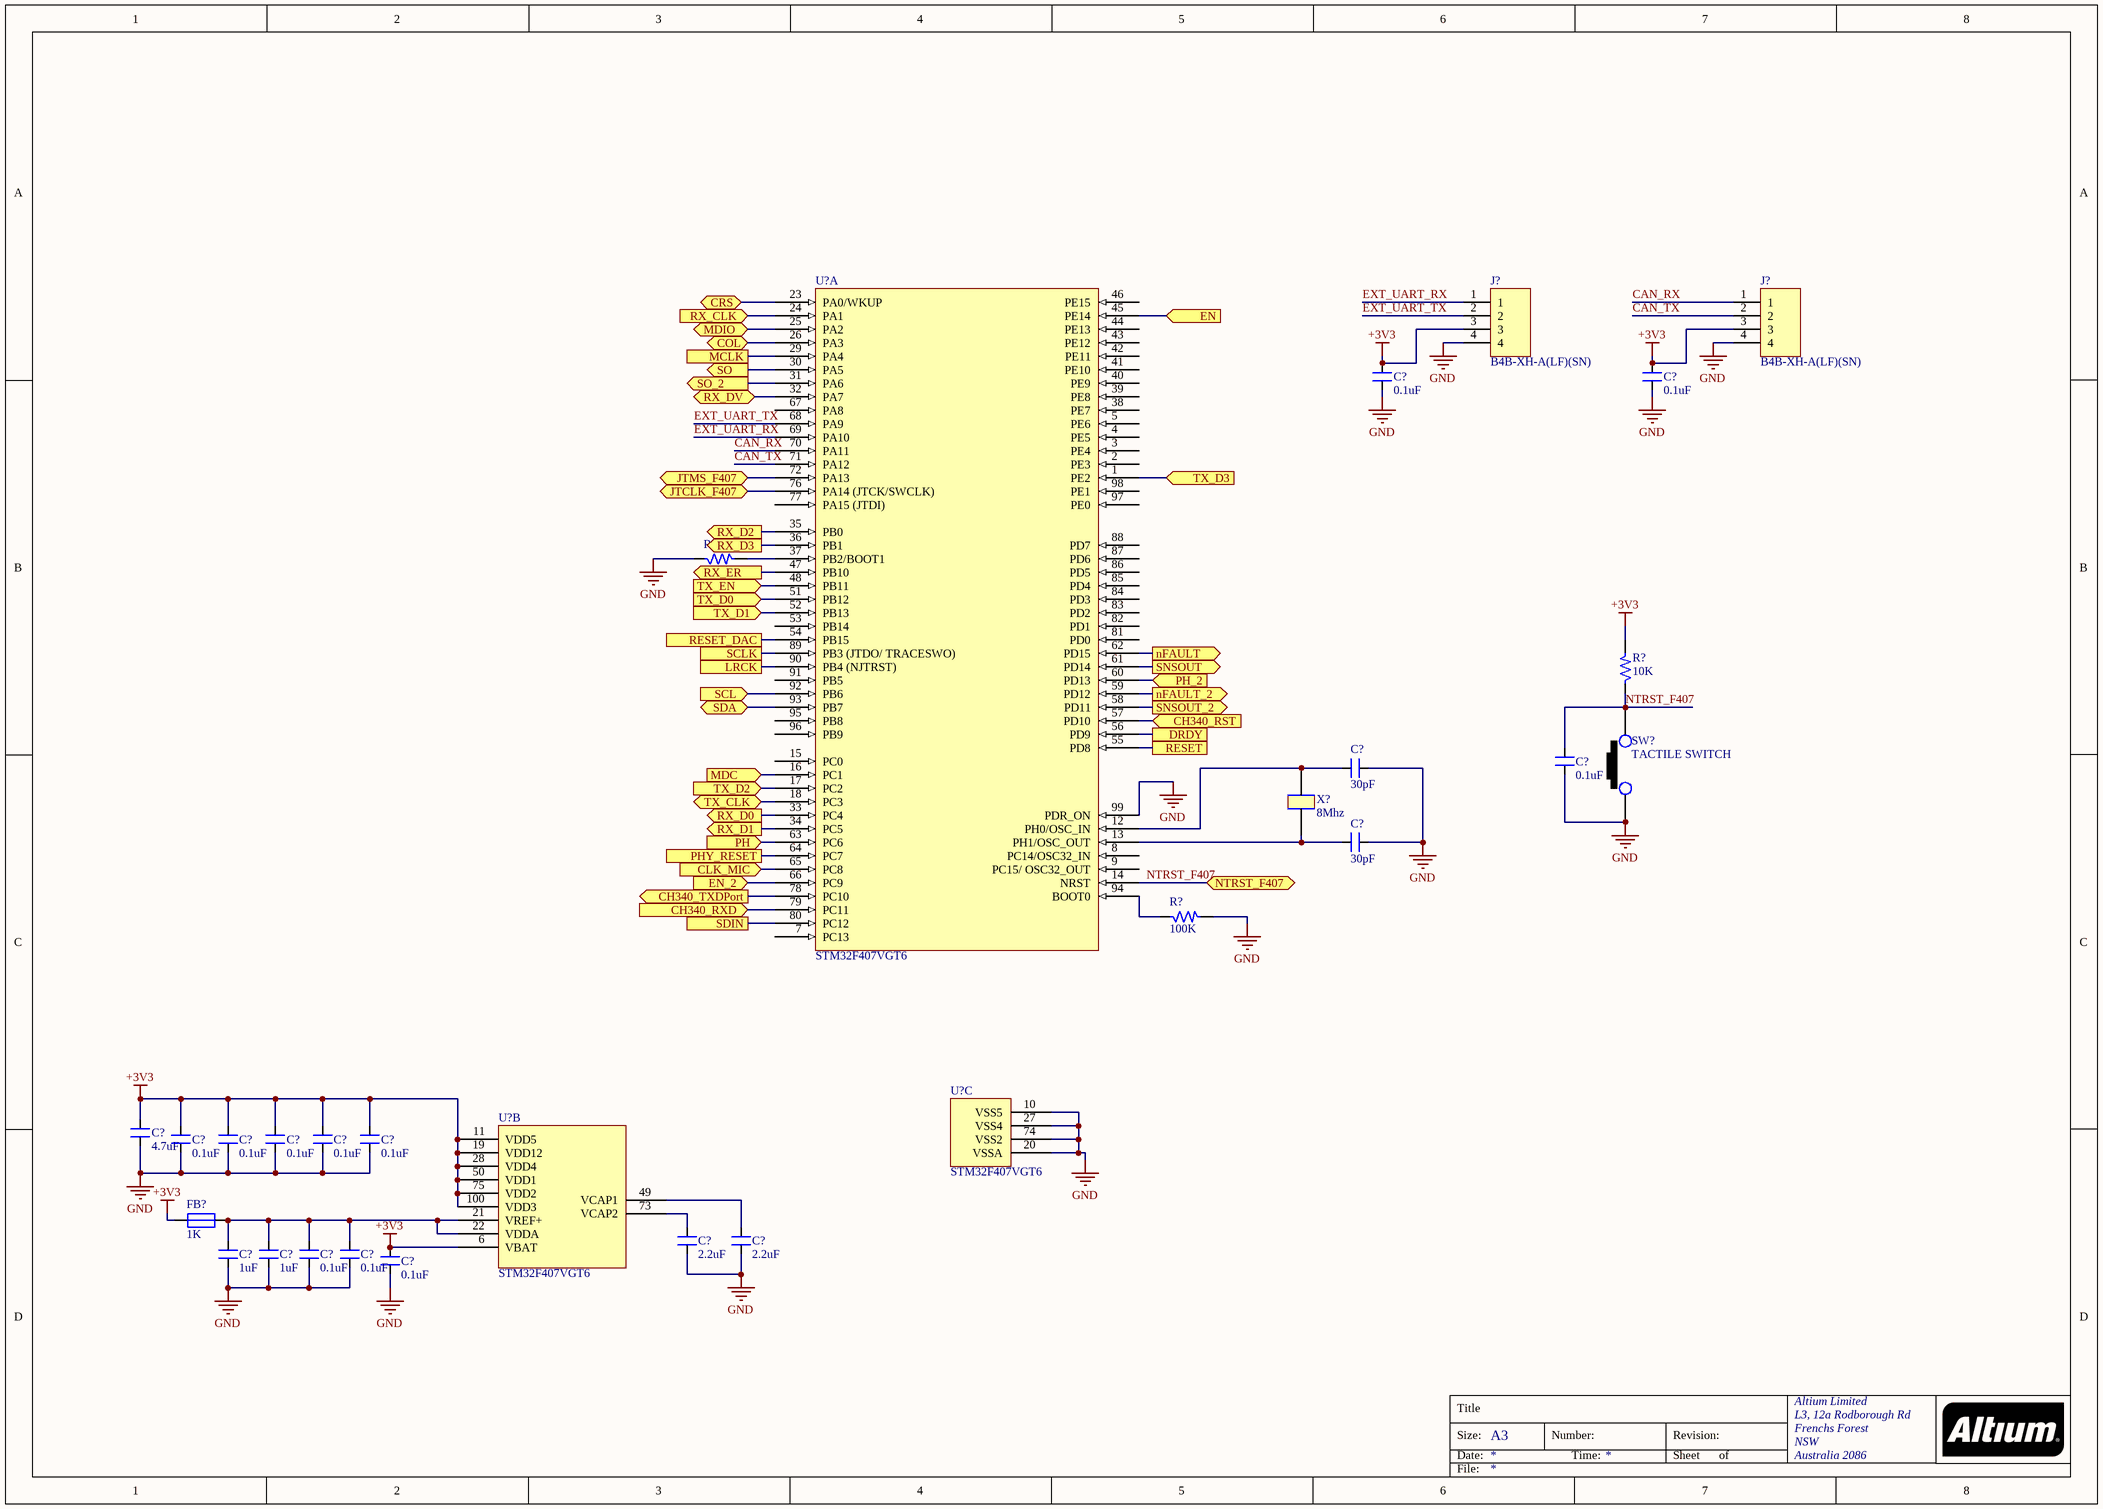
[diagram p6: [9]-STM32F407 Controller.SchDoc]

### Parts
(Parts that share a designator on the sheet are numbered #1, #2 ... from top to bottom, then left to right.)
C?#48  0.1uF  [CAP_0805]
C?#49  0.1uF  [CAP_0805]
C?#50  0.1uF  [CAP_0805]
C?#51  30pF  [CAP_0805]
C?#52  30pF  [CAP_0805]
C?#53  4.7uF  [CAP_0805]
C?#54  0.1uF  [CAP_0805]
C?#55  0.1uF  [CAP_0805]
C?#56  0.1uF  [CAP_0805]
C?#57  0.1uF  [CAP_0805]
C?#58  0.1uF  [CAP_0805]
C?#59  2.2uF  [CAP_0805]
C?#60  2.2uF  [CAP_0805]
C?#61  1uF  [CAP_0805]
C?#62  1uF  [CAP_0805]
C?#63  0.1uF  [CAP_0805]
C?#64  0.1uF  [CAP_0805]
C?#65  0.1uF  [CAP_0805]
FB?#3  1K  [IND_0805]
J?#7  B4B-XH-A(LF)(SN)  [CON4_100_B4B-XH-A_TH_ST]
J?#8  B4B-XH-A(LF)(SN)  [CON4_100_B4B-XH-A_TH_ST]
R?#29  100K  [RES_0603]
R?#30  10K  [RES_0603]
R?#31  100K  [RES_0603]
SW?#3  TACTILE SWITCH  [SW_342_SMD]
U?#7  STM32F407VGT6  [QFN100_19.6_669_58X10_SMD]  (part A of 3)
U?#8  STM32F407VGT6  [QFN100_19.6_669_58X10_SMD]  (part C of 3)
U?#9  STM32F407VGT6  [QFN100_19.6_669_58X10_SMD]  (part B of 3)
X?#2  8Mhz  [XTAL_314_240X47_SMD]

### Ports
CH340_RST (in), CH340_RXD (in), CH340_TXDPort (out), CLK_MIC (in), COL (bidir), CRS (bidir), DRDY, EN (in), EN_2 (in), JTCLK_F407 (bidir), JTMS_F407 (bidir), LRCK, MCLK, MDC (in), MDIO (bidir), nFAULT (out), nFAULT_2 (out), NTRST_F407 (bidir), PH (in), PH_2 (in), PHY_RESET, RESET, RESET_DAC, RX_CLK (in), RX_D0 (out), RX_D1 (out), RX_D2 (out), RX_D3 (out), RX_DV (bidir), RX_ER (out), SCL (in), SCLK, SDA (bidir), SDIN, SNSOUT (out), SNSOUT_2 (out), SO (out), SO_2 (out), TX_CLK (bidir), TX_D0 (in), TX_D1 (in), TX_D2 (in), TX_D3 (in), TX_EN (in)

### Nets
+3V3: C?#48.2 C?#49.2 C?#53.2 C?#54.2 C?#55.2 C?#56.2 C?#57.2 C?#58.2 C?#65.2 FB?#3.1 J?#7.3 J?#8.3 R?#30.2 U?#9.6(VBAT) U?#9.11(VDD5) U?#9.19(VDD12) U?#9.28(VDD4) U?#9.50(VDD1) U?#9.75(VDD2) U?#9.100(VDD3)
GND: C?#48.1 C?#49.1 C?#50.1 C?#51.2 C?#52.2 C?#53.1 C?#54.1 C?#55.1 C?#56.1 C?#57.1 C?#58.1 C?#59.1 C?#60.1 C?#61.1 C?#62.1 C?#63.1 C?#64.1 C?#65.1 J?#7.4 J?#8.4 R?#29.1 R?#31.2 SW?#3.1 U?#7.99(PDR_ON) U?#8.10(VSS5) U?#8.20(VSSA) U?#8.27(VSS4) U?#8.74(VSS2)  [project net SN]
CAN_RX: J?#8.1 U?#7.70(PA11)
CAN_TX: J?#8.2 U?#7.71(PA12)
CH340_RST: U?#7.57(PD10) ; port CH340_RST
CH340_RXD: U?#7.79(PC11) ; port CH340_RXD
CH340_TXDPort: U?#7.78(PC10) ; port CH340_TXDPort
CLK_MIC: U?#7.65(PC8) ; port CLK_MIC
COL: U?#7.26(PA3) ; port COL
CRS: U?#7.23(PA0/WKUP) ; port CRS
DRDY: U?#7.56(PD9) ; port DRDY
EN: U?#7.45(PE14) ; port EN
EN_2: U?#7.66(PC9) ; port EN_2
EXT_UART_RX: J?#7.1 U?#7.69(PA10)
EXT_UART_TX: J?#7.2 U?#7.68(PA9)
JTCLK_F407: U?#7.76(PA14_(JTCK/SWCLK)) ; port JTCLK_F407
JTMS_F407: U?#7.72(PA13) ; port JTMS_F407
LRCK: U?#7.90(PB4_(NJTRST)) ; port LRCK
MCLK: U?#7.29(PA4) ; port MCLK
MDC: U?#7.16(PC1) ; port MDC
MDIO: U?#7.25(PA2) ; port MDIO
nFAULT: U?#7.62(PD15) ; port nFAULT
nFAULT_2: U?#7.59(PD12) ; port nFAULT_2
NTRST_F407: C?#50.2 R?#30.1 SW?#3.2 U?#7.14(NRST) ; port NTRST_F407
PH: U?#7.63(PC6) ; port PH
PH_2: U?#7.60(PD13) ; port PH_2
PHY_RESET: U?#7.64(PC7) ; port PHY_RESET
RESET: U?#7.55(PD8) ; port RESET
RESET_DAC: U?#7.54(PB15) ; port RESET_DAC
RX_CLK: U?#7.24(PA1) ; port RX_CLK
RX_D0: U?#7.33(PC4) ; port RX_D0
RX_D1: U?#7.34(PC5) ; port RX_D1
RX_D2: U?#7.35(PB0) ; port RX_D2
RX_D3: U?#7.36(PB1) ; port RX_D3
RX_DV: U?#7.32(PA7) ; port RX_DV
RX_ER: U?#7.47(PB10) ; port RX_ER
SCL: U?#7.92(PB6) ; port SCL
SCLK: U?#7.89(PB3_(JTDO/_TRACESWO)) ; port SCLK
SDA: U?#7.93(PB7) ; port SDA
SDIN: U?#7.80(PC12) ; port SDIN
SNSOUT: U?#7.61(PD14) ; port SNSOUT
SNSOUT_2: U?#7.58(PD11) ; port SNSOUT_2
SO: U?#7.30(PA5) ; port SO
SO_2: U?#7.31(PA6) ; port SO_2
TX_CLK: U?#7.18(PC3) ; port TX_CLK
TX_D0: U?#7.51(PB12) ; port TX_D0
TX_D1: U?#7.52(PB13) ; port TX_D1
TX_D2: U?#7.17(PC2) ; port TX_D2
TX_D3: U?#7.1(PE2) ; port TX_D3
TX_EN: U?#7.48(PB11) ; port TX_EN
NetC?#51_1: C?#51.1 U?#7.12(PH0/OSC_IN) X?#2.2
NetC?#52_1: C?#52.1 U?#7.13(PH1/OSC_OUT) X?#2.1
NetC?#59_2: C?#59.2 U?#9.73(VCAP2)
NetC?#60_2: C?#60.2 U?#9.49(VCAP1)
NetC?#61_2: C?#61.2 C?#62.2 C?#63.2 C?#64.2 FB?#3.2 U?#9.21(VREF+) U?#9.22(VDDA)
NetR?#29_2: R?#29.2 U?#7.37(PB2/BOOT1)
NetR?#31_1: R?#31.1 U?#7.94(BOOT0)

Not connected (* = marked no-connect by the designer): U?#7 2(PE3) 3(PE4) 4(PE5) 5(PE6) 7(PC13) 8(PC14/OSC32_IN) 9(PC15/_OSC32_OUT) 15(PC0) 38(PE7) 39(PE8) 40(PE9) 41(PE10) 42(PE11) 43(PE12) 44(PE13) 46(PE15) 53(PB14) 67(PA8) 77(PA15_(JTDI)) 81(PD0) 82(PD1) 83(PD2) 84(PD3) 85(PD4) 86(PD5) 87(PD6) 88(PD7) 91(PB5) 95(PB8) 96(PB9) 97(PE0) 98(PE1)

### Notes on the sheet
- Title
- Size:
- Date:
- A3
- Number:
- Time:
- Revision:
- Sheet
- of
- File:

### Library data of the parts
C?#48-C?#50 C?#54-C?#58 C?#63-C?#65 = CAP_0.1uF-50V-10%-0805: as C?#2 on sheet [3]-STM32F103 Debugger; Case/Package: 0805; Supplier-1: SIRICOM; Supplier Part Number-1: 0805B104K500CT
C?#51 C?#52 = CAP_30pF-50V-10%-0805: as C?#5 on sheet [3]-STM32F103 Debugger; Case/Package: 0805; Supplier-1: Digikey; Supplier Part Number-1: 399-17443-1-ND - Cut Tape (CT)
C?#53 = CAP_4.7uF-50V-10%-0805: as C?#1 on sheet [3]-STM32F103 Debugger; Case/Package: 0805; Supplier-1: SIRICOM; Supplier Part Number-1: CL21A475KBQNNNE
C?#59 C?#60 = CAP_2.2uF-25V-10%-0805: 2.2µF ±10% 25V Ceramic Capacitor X7R 0805 (2012 Metric) /; Manufacturer: KEMET; Manufacturer Part Number: CL21B225KAFNFNE; Alternate Part Number-1: NA; Case/Package: 0805; Supplier-1: SIRICOM; Supplier Part Number-1: CL21A225KAFNNNE
C?#61 C?#62 = CAP_1uF-50V-5%-0805: as C?#7 on sheet [3]-STM32F103 Debugger; Case/Package: 0805; Supplier-1: SIRICOM; Supplier Part Number-1: CL21B105KBFNNNE
FB?#3 = FB_1K-100MHZ-1.6A-0805: as FB?#1 on sheet [4]- Ethernet PHY; Case/Package: 0805; Supplier-1: SIRICOM; Supplier Part Number-1: ACMS201209A102
J?#7 J?#8 = CON-PLG_4X1-100-ST-TH: 4 Pins, 1 Row 2.54mm Pitch, straight Connector, male; Manufacturer: Wurth Electronics; Mating Part Number: XHP-4; Crimp Part Number: ASXHSXH22K51; Alternate Part Number-1: NA; Manufacturer Part Number: B4B-XH-A(LF)(SN); Case/Package: TH-CON; Supplier-1: LCSC; Supplier Part Number-1: B4B-XH-A(LF)(SN)
R?#29 R?#31 = RES_100K-0.1W-1%-0603: as R?#1 on sheet [3]-STM32F103 Debugger; Case/Package: 0603; Supplier-1: Arrow; Supplier Part Number-1: RMCF0603FT100K
R?#30 = RES_10K-0.1W-1%-0603: as R?#4 on sheet [3]-STM32F103 Debugger; Case/Package: 0603; Supplier-1: SIRICOM; Supplier Part Number-1: WR06X1002FTL
SW?#3 = SW1_RS-282G05A3-SMRT-SMD: as SW?#1 on sheet [3]-STM32F103 Debugger; Manufacturer Part Number: RS-282G05A3-SMRT; Case/Package: SMD; Supplier-1: SP ROAD; Supplier Part Number-1: RS-282G05A3-SMRT
U?#7-U?#9 = IC_STM32F407VGT6: ARM® Cortex®-M4 STM32F4 Microcontroller IC 32-Bit 168MHz 1MB (1M x 8) FLASH 100-LQFP (14x14) /; Manufacturer: STMicroelectronics; Alternate Part Number-1: STM32F407VET6; Manufacturer Part Number: STM32F407VGT6; Case/Package: LQFP100; Supplier-1: ARROW; Supplier Part Number-1: STM32F407VGT6
X?#2 = XTAL_8MHZ-ECS-80-32-5PX-SMD: as X?#1 on sheet [3]-STM32F103 Debugger; Case/Package: SMD/SMT; Supplier-1: SP ROAD; Supplier Part Number-1: ECS-80-32-5PX-TR

## Sheet [10]-Motor Driver-2.SchDoc
size A4
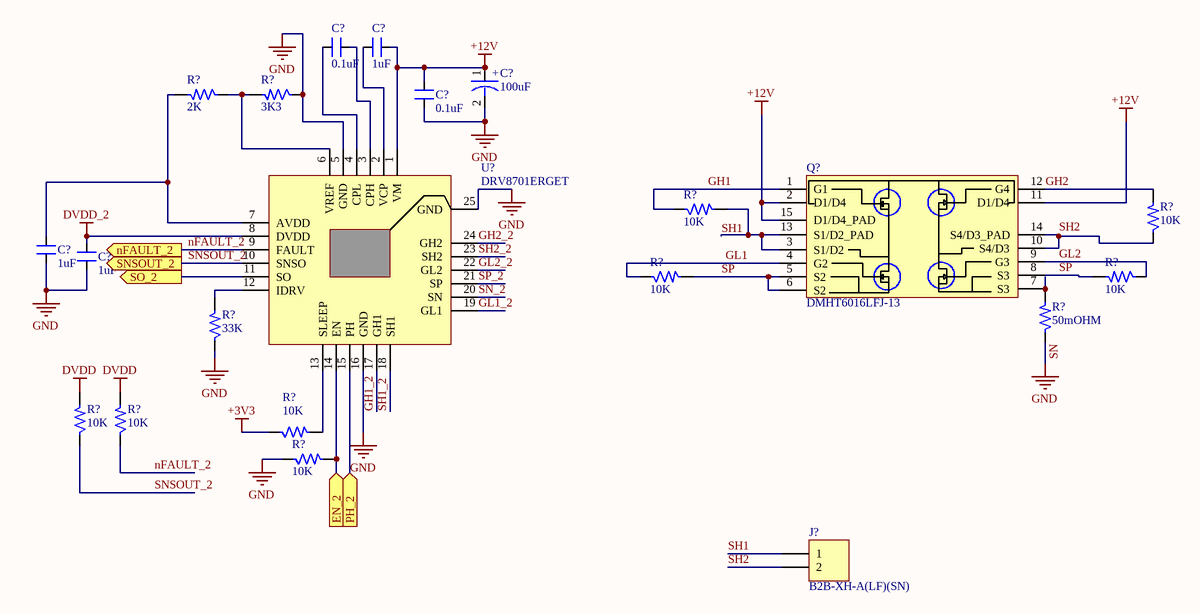
[diagram p7: [10]-Motor Driver-2.SchDoc]

### Parts
(Parts that share a designator on the sheet are numbered #1, #2 ... from top to bottom, then left to right.)
C?#66  0.1uF  [CAP_0805]
C?#67  1uF  [CAP_0805]
C?#68  100uF  [ACAP_P236_D305_H303_RAD]
C?#69  0.1uF  [CAP_0805]
C?#70  1uF  [CAP_0805]
C?#71  1uF  [CAP_0805]
J?#9  B2B-XH-A(LF)(SN)  [CON2_100_B2B-XH-A_TH_ST]
Q?#2  DMHT6016LFJ-13  [DFN5045-12_33_212_27X15_SMD_1]
R?#32  2K  [RES_0603]
R?#33  3K3  [RES_0603]
R?#34  10K  [RES_0603]
R?#35  10K  [RES_0603]
R?#36  10K  [RES_0603]
R?#37  10K  [RES_0603]
R?#38  50mOHM  [RES_2512]
R?#39  33K  [RES_0805]
R?#40  10K  [RES_0603]
R?#41  10K  [RES_0603]
R?#42  10K  [RES_0603]
R?#43  10K  [RES_0603]
U?#10  DRV8701ERGET  [VFQFN24_19.6_196_12X32_SMD_1]

### Ports
EN_2 (in), nFAULT_2 (out), PH_2 (in), SNSOUT_2 (out), SO_2 (out)

### Nets
+3V3: R?#40.1
+12V: C?#67.2 C?#68.1 C?#69.2 Q?#2.2(D1/D4) Q?#2.11(D1/D4) Q?#2.15(D1/D4_PAD) U?#10.1(VM)
DVDD: R?#41.2 R?#42.2
DVDD_2: C?#71.2 U?#10.8(DVDD)
SN: C?#68.2 C?#69.1 C?#70.1 C?#71.1 R?#33.1 R?#38.1 R?#39.1 R?#43.1 U?#10.5(GND) U?#10.16(GND) U?#10.25(GND)  [also labelled GND]
EN_2: R?#43.2 U?#10.14(EN) ; port EN_2
GH1: Q?#2.1(G1) R?#34.1
GH1_2: U?#10.17(GH1)
GH2: Q?#2.12(G4) R?#35.2
GH2_2: U?#10.24(GH2)
GL1: Q?#2.4(G2) R?#36.1
GL1_2: U?#10.19(GL1)
GL2: Q?#2.9(G3) R?#37.1
GL2_2: U?#10.22(GL2)
nFAULT_2: R?#42.1 U?#10.9(FAULT) ; port nFAULT_2
PH_2: U?#10.15(PH) ; port PH_2
SH1: J?#9.1 Q?#2.3(S1/D2) Q?#2.13(S1/D2_PAD) R?#34.2
SH1_2: U?#10.18(SH1)
SH2: J?#9.2 Q?#2.10(S4/D3) Q?#2.14(S4/D3_PAD) R?#35.1
SH2_2: U?#10.23(SH2)
SN_2: U?#10.20(SN)
SNSOUT_2: R?#41.1 U?#10.10(SNSO) ; port SNSOUT_2
SO_2: U?#10.11(SO) ; port SO_2
SP: Q?#2.5(S2) Q?#2.6(S2) Q?#2.8(S3) R?#36.2 R?#37.2
SP_2: U?#10.21(SP)
NetC?#66_1: C?#66.1 U?#10.3(CPH)
NetC?#66_2: C?#66.2 U?#10.4(CPL)
NetC?#67_1: C?#67.1 U?#10.2(VCP)
NetC?#70_2: C?#70.2 R?#32.2 U?#10.7(AVDD)
NetQ?#2_7: Q?#2.7(S3) R?#38.2
NetR?#32_1: R?#32.1 R?#33.2 U?#10.6(VREF)
NetR?#39_2: R?#39.2 U?#10.12(IDRV)
NetR?#40_2: R?#40.2 U?#10.13(SLEEP)

### Notes on the sheet
- (in symbol CAP-P_100uF-25V-20%-RAD) +

### Library data of the parts
C?#66 C?#69 = CAP_0.1uF-50V-10%-0805: as C?#2 on sheet [3]-STM32F103 Debugger; Case/Package: 0805; Supplier-1: SIRICOM; Supplier Part Number-1: 0805B104K500CT
C?#67 C?#70 C?#71 = CAP_1uF-50V-5%-0805: as C?#7 on sheet [3]-STM32F103 Debugger; Case/Package: 0805; Supplier-1: SIRICOM; Supplier Part Number-1: CL21B105KBFNNNE
C?#68 = CAP-P_100uF-25V-20%-RAD: as C?#24 on sheet [5]-Motor Driver Schematic; Case/Package: Radial-SMD; Supplier-1: SP ROAD; Supplier Part Number-1: UWT1E101MCL1GS
J?#9 = CON-PLG_2X1-100-ST-TH: as J?#4 on sheet [5]-Motor Driver Schematic; Manufacturer Part Number: B2B-XH-A(LF)(SN); Case/Package: TH-CON; Supplier-1: SP ROAD; Supplier Part Number-1: B2B-XH-A(LF)(SN)
Q?#2 = MOSFET-N_60V-14.8A-V-DFN5045-12: as Q?#1 on sheet [5]-Motor Driver Schematic; Manufacturer Part Number: DMHT6016LFJ-13; Case/Package: DFN5045-12; Supplier-1: LCSC; Supplier Part Number-1: C460986
R?#32 = RES_2K-0.125W-1%-0603: as R?#13 on sheet [5]-Motor Driver Schematic; Case/Package: 0603; Supplier-1: SIRICOM; Supplier Part Number-1: WR06X2001FTL
R?#33 = RES_3.3K-0.1W-1%-0603: as R?#5 on sheet [4]- Ethernet PHY; Case/Package: 0603; Supplier-1: SIRICOM; Supplier Part Number-1: WR06X3301FTL
R?#34-R?#37 R?#40-R?#43 = RES_10K-0.1W-1%-0603: as R?#4 on sheet [3]-STM32F103 Debugger; Case/Package: 0603; Supplier-1: SIRICOM; Supplier Part Number-1: WR06X1002FTL
R?#38 = RES_50mOhm-2W-1%-2512: as R?#19 on sheet [5]-Motor Driver Schematic; Case/Package: 2512; Supplier-1: SIRICOM; Supplier Part Number-1: LR2512-22R060F1
R?#39 = RES_33K-0.125W-1%-0805: as R?#20 on sheet [5]-Motor Driver Schematic; Case/Package: 0805; Supplier-1: SIRICOM; Supplier Part Number-1: WR08X3302FTL
U?#10 = IC_DRV8701ERGET: as U?#3 on sheet [5]-Motor Driver Schematic; Manufacturer Part Number: DRV8701ERGET; Case/Package: VFQFN24; Supplier-1: ARROW; Supplier Part Number-1: DRV8701ERGET

## Sheet [11]- Power Input and Regulators.SchDoc
size A4
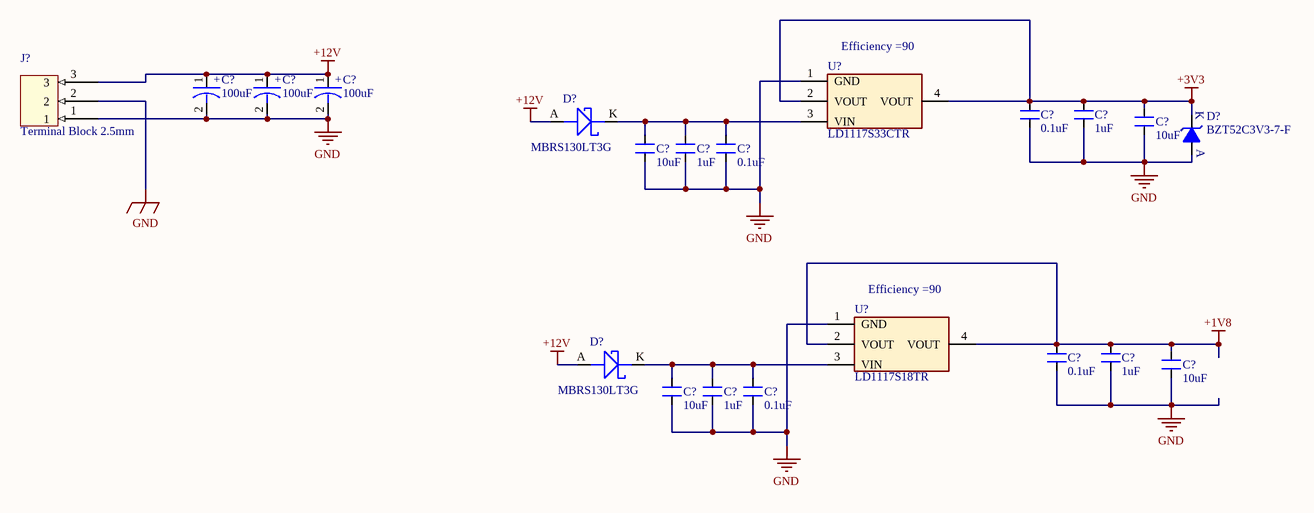
[diagram p8: [11]- Power Input and Regulators.SchDoc]

### Parts
(Parts that share a designator on the sheet are numbered #1, #2 ... from top to bottom, then left to right.)
C?#72  100uF  [ACAP_P305_D393_H393_RAD]
C?#73  100uF  [ACAP_P305_D393_H393_RAD]
C?#74  100uF  [ACAP_P305_D393_H393_RAD]
C?#75  0.1uF  [CAP_0805]
C?#76  1uF  [CAP_0805]
C?#77  10uF  [CAP_1206]
C?#78  10uF  [CAP_1206]
C?#79  1uF  [CAP_0805]
C?#80  0.1uF  [CAP_0805]
C?#81  0.1uF  [CAP_0805]
C?#82  1uF  [CAP_0805]
C?#83  10uF  [CAP_1206]
C?#84  10uF  [CAP_1206]
C?#85  1uF  [CAP_0805]
C?#86  0.1uF  [CAP_0805]
D?#5  MBRS130LT3G  [DIO_SMB_DO-214AA]
D?#6  BZT52C3V3-7-F  [DIO_SOD-123]
D?#7  MBRS130LT3G  [DIO_SMB_DO-214AA]
J?#10  Terminal Block 2.5mm  [CON3_100_TB_TH_ST]
U?#11  LD1117S33CTR  [SOT223_3]
U?#12  LD1117S18TR  [SOT223_3]

### Nets
+1V8: C?#81.2 C?#82.2 C?#83.2 U?#12.2(VOUT) U?#12.4(VOUT)
+3V3: C?#75.2 C?#76.2 C?#77.2 D?#6.K U?#11.2(VOUT) U?#11.4(VOUT)
+12V: C?#72.1 C?#73.1 C?#74.1 D?#5.A D?#7.A J?#10.3
GND: C?#72.2 C?#73.2 C?#74.2 C?#75.1 C?#76.1 C?#77.1 C?#78.1 C?#79.1 C?#80.1 C?#81.1 C?#82.1 C?#83.1 C?#84.1 C?#85.1 C?#86.1 D?#6.A J?#10.1 J?#10.2 U?#11.1(GND) U?#12.1(GND)  [project net SN]
NetC?#78_2: C?#78.2 C?#79.2 C?#80.2 D?#5.K U?#11.3(VIN)
NetC?#84_2: C?#84.2 C?#85.2 C?#86.2 D?#7.K U?#12.3(VIN)

### Notes on the sheet
- (near U?#11) Efficiency =90
- (near U?#12) Efficiency =90
- (in symbol CAP-P_100uF-50V-20%-RAD) +

### Library data of the parts
C?#72-C?#74 = CAP-P_100uF-50V-20%-RAD: 100µF 50V Aluminum Polymer Capacitor Radial, Can - SMD 28mOhm 4000 Hrs @ 125°C /; Manufacturer: Nichicon; Manufacturer Part Number: GYA1H101MCQ1GS; Alternate Part Number-1: VEU101M1HTR-1010; Case/Package: Radial-SMD; Supplier-1: SP ROAD; Supplier Part Number-1: GYA1H101MCQ1GS
C?#75 C?#80 C?#81 C?#86 = CAP_0.1uF-50V-10%-0805: as C?#2 on sheet [3]-STM32F103 Debugger; Case/Package: 0805; Supplier-1: SIRICOM; Supplier Part Number-1: 0805B104K500CT
C?#76 C?#79 C?#82 C?#85 = CAP_1uF-50V-5%-0805: as C?#7 on sheet [3]-STM32F103 Debugger; Case/Package: 0805; Supplier-1: SIRICOM; Supplier Part Number-1: CL21B105KBFNNNE
C?#77 C?#78 C?#83 C?#84 = CAP_10uF-50V-10%-1206: as C?#11 on sheet [4]- Ethernet PHY; Case/Package: 1206; Supplier-1: SIRICOM; Supplier Part Number-1: CC1206KKX5R9BB106
D?#5 D?#7 = DIO-S_445mV-30V-2A-SMB: Diode Schottky 30V 2A Surface Mount SMB; Manufacturer: ON Semiconductor; Alternate Part Number-1: NA; Manufacturer Part Number: MBRS130LT3G; Case/Package: SMB; Supplier-1: ARROW; Supplier Part Number-1: MBRS130LT3G
D?#6 = DIO-Z_3.3V-500mW-SOD123: Zener Diode 3.3V 500mW ±6% Surface Mount SOD-123 /; Manufacturer: Diodes Incorporated; Alternate Part Number-1: NA; Manufacturer Part Number: BZT52C3V3-7-F; Case/Package: SOD-123; Supplier-1: Digikey; Supplier Part Number-1: BZT52C3V3-FDICT-ND
J?#10 = CON-TB_3X1-100-ST-TH: 3 Pins, 1 Row 2.54mm Pitch, straight Connector, male; Manufacturer Part Number: 1725669; Manufacturer: Phoenix Contact; Alternate Part Number-1: NA; Case/Package: TH-CON; Supplier-1: SP ROAD; Supplier Part Number-1: 1725669
U?#11 = REG_15V-3.3V-0.9A-12W-SOT223: Linear Voltage Regulator IC 1 Output 800mA SOT-223; Manufacturer: STMicroelectronics; Alternate Part Number-1: NA; Manufacturer Part Number: LD1117S33CTR; Case/Package: SOT223; Supplier-1: SP ROAD; Supplier Part Number-1: LD1117S33CTR
U?#12 = REG_15V-1.8V-0.8A-1.4W-SOT223: LDO Voltage Regulators 1.8V 0.8A Positive; Manufacturer: STMicroelectronics; Alternate Part Number-1: NA; Manufacturer Part Number: LD1117S18TR; Case/Package: SOT-223-3; Supplier-1: Mouser; Supplier Part Number-1: 511-LD1117S18-TR

## Nets that join several sheets
+1V8: [8]-DAC and MIC (C?#32.2 C?#33.2 FB?#2.1 U?#5.34), [11]- Power Input and Regulators (5 pins)
+3V3: [3]-STM32F103 Debugger (14 pins), [5]-Motor Driver Schematic (R?#21.1), [6]-CH340C (C?#28.2 U?#4.4 U?#4.16), [8]-DAC and MIC (12 pins), [9]-STM32F407 Controller (20 pins), [10]-Motor Driver-2 (R?#40.1), [11]- Power Input and Regulators (6 pins)
+12V: [5]-Motor Driver Schematic (7 pins), [10]-Motor Driver-2 (7 pins), [11]- Power Input and Regulators (6 pins)
DVDD: [5]-Motor Driver Schematic (C?#27.2 R?#22.2 R?#23.2 U?#3.8), [10]-Motor Driver-2 (R?#41.2 R?#42.2)
SN: [3]-STM32F103 Debugger (19 pins), [4]- Ethernet PHY (20 pins), [5]-Motor Driver Schematic (12 pins), [6]-CH340C (C?#28.1 J?#5.5 J?#5.6 U?#4.1), [8]-DAC and MIC (23 pins), [9]-STM32F407 Controller (28 pins), [10]-Motor Driver-2 (11 pins), [11]- Power Input and Regulators (20 pins)
CH340_RST: [6]-CH340C (U?#4.14), [9]-STM32F407 Controller (U?#7.57)
CH340_RXD: [6]-CH340C (U?#4.3), [9]-STM32F407 Controller (U?#7.79)
CH340_TXDPort: [6]-CH340C (U?#4.2), [9]-STM32F407 Controller (U?#7.78)
CLK_MIC: [8]-DAC and MIC (U?#6.3), [9]-STM32F407 Controller (U?#7.65)
COL: [4]- Ethernet PHY (DS?#1.A U?#2.28), [9]-STM32F407 Controller (U?#7.26)
CRS: [4]- Ethernet PHY (DS?#2.A U?#2.29), [9]-STM32F407 Controller (U?#7.23)
EN: [5]-Motor Driver Schematic (R?#24.2 U?#3.14), [9]-STM32F407 Controller (U?#7.45)
EN_2: [9]-STM32F407 Controller (U?#7.66), [10]-Motor Driver-2 (R?#43.2 U?#10.14)
JTCLK_F407: [3]-STM32F103 Debugger (U?#1.18), [9]-STM32F407 Controller (U?#7.76)
JTMS_F407: [3]-STM32F103 Debugger (U?#1.25 U?#1.27), [9]-STM32F407 Controller (U?#7.72)
LRCK: [8]-DAC and MIC (U?#5.40), [9]-STM32F407 Controller (U?#7.90)
MCLK: [8]-DAC and MIC (U?#5.37), [9]-STM32F407 Controller (U?#7.29)
MDC: [4]- Ethernet PHY (U?#2.12), [9]-STM32F407 Controller (U?#7.16)
MDIO: [4]- Ethernet PHY (R?#10.2 U?#2.11), [9]-STM32F407 Controller (U?#7.25)
nFAULT: [5]-Motor Driver Schematic (R?#23.1 U?#3.9), [9]-STM32F407 Controller (U?#7.62)
nFAULT_2: [9]-STM32F407 Controller (U?#7.59), [10]-Motor Driver-2 (R?#42.1 U?#10.9)
NTRST_F407: [3]-STM32F103 Debugger (U?#1.26), [9]-STM32F407 Controller (C?#50.2 R?#30.1 SW?#3.2 U?#7.14)
PH: [5]-Motor Driver Schematic (U?#3.15), [9]-STM32F407 Controller (U?#7.63)
PH_2: [9]-STM32F407 Controller (U?#7.60), [10]-Motor Driver-2 (U?#10.15)
PHY_RESET: [4]- Ethernet PHY (R?#7.1 SW?#2.2 U?#2.32), [9]-STM32F407 Controller (U?#7.64)
RESET_DAC: [8]-DAC and MIC (R?#27.1 U?#5.32), [9]-STM32F407 Controller (U?#7.54)
RX_CLK: [4]- Ethernet PHY (U?#2.19), [9]-STM32F407 Controller (U?#7.24)
RX_D0: [4]- Ethernet PHY (U?#2.16), [9]-STM32F407 Controller (U?#7.33)
RX_D1: [4]- Ethernet PHY (U?#2.15), [9]-STM32F407 Controller (U?#7.34)
RX_D2: [4]- Ethernet PHY (U?#2.14), [9]-STM32F407 Controller (U?#7.35)
RX_D3: [4]- Ethernet PHY (U?#2.13), [9]-STM32F407 Controller (U?#7.36)
RX_DV: [4]- Ethernet PHY (U?#2.18), [9]-STM32F407 Controller (U?#7.32)
RX_ER: [4]- Ethernet PHY (U?#2.20), [9]-STM32F407 Controller (U?#7.47)
SCL: [8]-DAC and MIC (U?#5.2), [9]-STM32F407 Controller (U?#7.92)
SCLK: [8]-DAC and MIC (U?#5.38), [9]-STM32F407 Controller (U?#7.89)
SDA: [8]-DAC and MIC (U?#5.1), [9]-STM32F407 Controller (U?#7.93)
SDIN: [8]-DAC and MIC (U?#5.39), [9]-STM32F407 Controller (U?#7.80)
SNSOUT: [5]-Motor Driver Schematic (R?#22.1 U?#3.10), [9]-STM32F407 Controller (U?#7.61)
SNSOUT_2: [9]-STM32F407 Controller (U?#7.58), [10]-Motor Driver-2 (R?#41.1 U?#10.10)
SO: [5]-Motor Driver Schematic (U?#3.11), [9]-STM32F407 Controller (U?#7.30)
SO_2: [9]-STM32F407 Controller (U?#7.31), [10]-Motor Driver-2 (U?#10.11)
TX_CLK: [4]- Ethernet PHY (U?#2.22), [9]-STM32F407 Controller (U?#7.18)
TX_D0: [4]- Ethernet PHY (U?#2.24), [9]-STM32F407 Controller (U?#7.51)
TX_D1: [4]- Ethernet PHY (U?#2.25), [9]-STM32F407 Controller (U?#7.52)
TX_D2: [4]- Ethernet PHY (U?#2.26), [9]-STM32F407 Controller (U?#7.17)
TX_D3: [4]- Ethernet PHY (U?#2.27), [9]-STM32F407 Controller (U?#7.1)
TX_EN: [4]- Ethernet PHY (U?#2.23), [9]-STM32F407 Controller (U?#7.48)